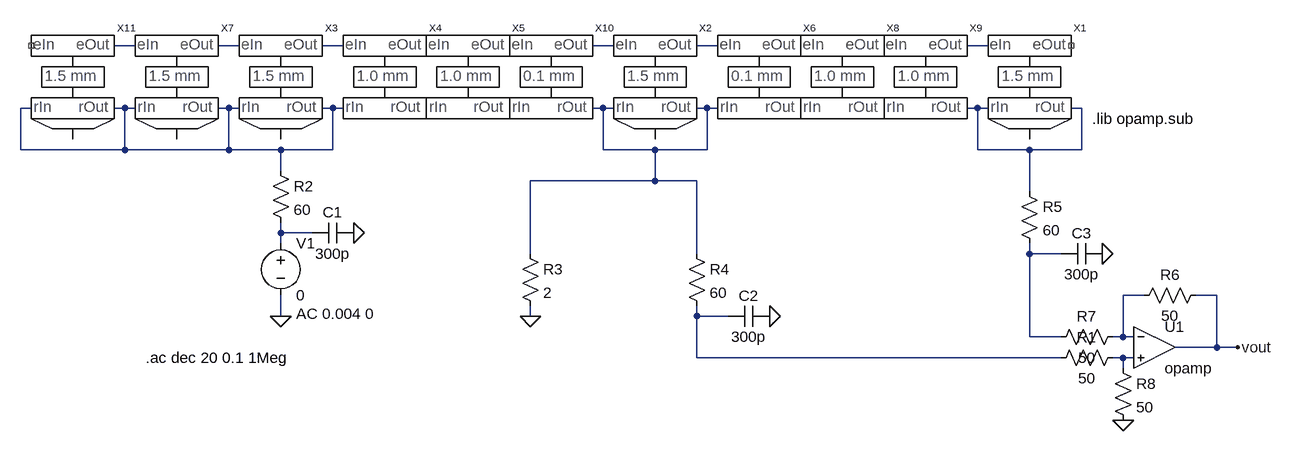
[diagram p0: schematic 0_nstCircuitSim.asc]
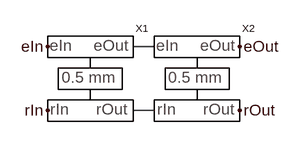
[diagram p1: sub-circuit baseunit_1p0mm.asc]
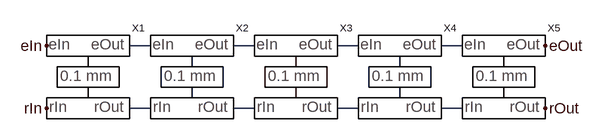
[diagram p2: sub-circuit baseunit_0p5mm.asc]
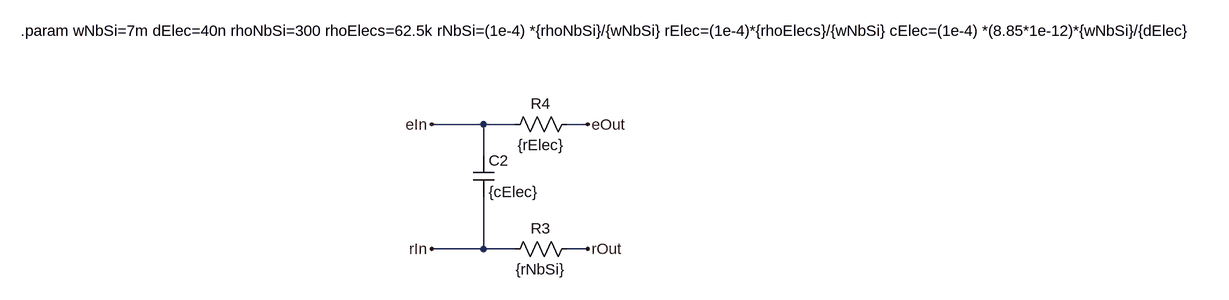
[diagram p3: sub-circuit baseunit_0p1mm.asc]
0_nstCircuitSim.asc, the LTspice schematic file:
Version 4
SHEET 1 1276 692
WIRE -624 96 -656 96
WIRE -464 96 -496 96
WIRE -304 96 -336 96
WIRE 112 96 80 96
WIRE 272 96 240 96
WIRE 688 96 656 96
WIRE -784 192 -800 192
WIRE -640 192 -656 192
WIRE -624 192 -640 192
WIRE -480 192 -496 192
WIRE -464 192 -480 192
WIRE -320 192 -336 192
WIRE -304 192 -320 192
WIRE 96 192 80 192
WIRE 112 192 96 192
WIRE 256 192 240 192
WIRE 272 192 256 192
WIRE 672 192 656 192
WIRE 688 192 672 192
WIRE 832 192 816 192
WIRE -800 256 -800 192
WIRE -640 256 -640 192
WIRE -640 256 -800 256
WIRE -480 256 -480 192
WIRE -480 256 -640 256
WIRE -400 256 -480 256
WIRE -320 256 -320 192
WIRE -320 256 -400 256
WIRE 96 256 96 192
WIRE 176 256 96 256
WIRE 256 256 256 192
WIRE 256 256 176 256
WIRE 672 256 672 192
WIRE 752 256 672 256
WIRE 832 256 832 192
WIRE 832 256 752 256
WIRE -400 288 -400 256
WIRE 176 304 176 256
WIRE 176 304 -16 304
WIRE 240 304 176 304
WIRE 752 320 752 256
WIRE -400 384 -400 368
WIRE -352 384 -400 384
WIRE -400 400 -400 384
WIRE -16 416 -16 304
WIRE 240 416 240 304
WIRE 752 416 752 400
WIRE 800 416 752 416
WIRE 928 480 896 480
WIRE 1040 480 1008 480
WIRE -400 512 -400 480
WIRE -16 512 -16 496
WIRE 240 512 240 496
WIRE 288 512 240 512
WIRE 752 544 752 416
WIRE 800 544 752 544
WIRE 896 544 896 480
WIRE 896 544 880 544
WIRE 912 544 896 544
WIRE 1040 560 1040 480
WIRE 1040 560 976 560
WIRE 1072 560 1040 560
WIRE 240 576 240 512
WIRE 800 576 240 576
WIRE 896 576 880 576
WIRE 912 576 896 576
WIRE 896 592 896 576
FLAG -16 512 0
FLAG -400 512 0
FLAG 1072 560 vout
FLAG 864 416 0
FLAG 352 512 0
FLAG -288 384 0
FLAG 896 672 0
SYMBOL voltage -400 384 R0
WINDOW 123 24 124 Left 2
WINDOW 39 0 0 Left 0
SYMATTR Value2 AC 0.004 0
SYMATTR InstName V1
SYMATTR Value 0
SYMBOL OpAmps\\opamp 944 496 R0
SYMATTR InstName U1
SYMBOL res -416 272 R0
SYMATTR InstName R2
SYMATTR Value 60
SYMBOL res -32 400 R0
SYMATTR InstName R3
SYMATTR Value 2
SYMBOL res 224 400 R0
SYMATTR InstName R4
SYMATTR Value 60
SYMBOL res 736 304 R0
SYMATTR InstName R5
SYMATTR Value 60
SYMBOL baseUnit_1p0mm -240 144 R0
SYMATTR InstName X4
SYMBOL baseUnit_1p0mm -112 144 R0
SYMATTR InstName X5
SYMBOL baseUnit_1p0mm 464 144 R0
SYMATTR InstName X8
SYMBOL baseUnit_1p0mm 592 144 R0
SYMATTR InstName X9
SYMBOL baseUnit_0p1mm 336 144 R0
SYMATTR InstName X6
SYMBOL cap -288 368 R90
WINDOW 0 0 32 VBottom 2
WINDOW 3 32 32 VTop 2
SYMATTR InstName C1
SYMATTR Value 300p
SYMBOL cap 352 496 R90
WINDOW 0 0 32 VBottom 2
WINDOW 3 32 32 VTop 2
SYMATTR InstName C2
SYMATTR Value 300p
SYMBOL cap 864 400 R90
WINDOW 0 0 32 VBottom 2
WINDOW 3 32 32 VTop 2
SYMATTR InstName C3
SYMATTR Value 300p
SYMBOL res 896 560 R90
WINDOW 0 0 56 VBottom 2
WINDOW 3 32 56 VTop 2
SYMATTR InstName R1
SYMATTR Value 50
SYMBOL res 1024 464 R90
WINDOW 0 0 56 VBottom 2
WINDOW 3 32 56 VTop 2
SYMATTR InstName R6
SYMATTR Value 50
SYMBOL res 896 528 R90
WINDOW 0 0 56 VBottom 2
WINDOW 3 32 56 VTop 2
SYMATTR InstName R7
SYMATTR Value 50
SYMBOL res 880 576 R0
SYMATTR InstName R8
SYMATTR Value 50
SYMBOL contactUnit_1p5mm -400 144 R0
SYMATTR InstName X3
SYMBOL contactUnit_1p5mm -560 144 R0
SYMATTR InstName X7
SYMBOL baseUnit_0p1mm 16 144 R0
SYMATTR InstName X10
SYMBOL contactUnit_1p5mm 752 144 R0
SYMATTR InstName X1
SYMBOL contactUnit_1p5mm 176 144 R0
SYMATTR InstName X2
SYMBOL contactUnit_1p5mm -720 144 R0
SYMATTR InstName X11
TEXT 848 208 Left 2 !.lib opamp.sub
TEXT -608 576 Left 2 !.ac dec 20 0.1 1Meg

baseunit_1p0mm.asc, the sub-circuit schematic file:
Version 4
SHEET 1 880 680
WIRE 112 80 80 80
WIRE 112 176 80 176
FLAG -48 80 eIn
FLAG -48 176 rIn
FLAG 240 80 eOut
FLAG 240 176 rOut
SYMBOL baseUnit_0p5mm 16 128 R0
SYMATTR InstName X1
SYMBOL baseUnit_0p5mm 176 128 R0
SYMATTR InstName X2

baseunit_0p5mm.asc, the sub-circuit schematic file:
Version 4
SHEET 1 880 680
WIRE 112 80 80 80
WIRE 272 80 240 80
WIRE 432 80 400 80
WIRE 592 80 560 80
WIRE 112 176 80 176
WIRE 272 176 240 176
WIRE 432 176 400 176
WIRE 592 176 560 176
FLAG -48 80 eIn
FLAG -48 176 rIn
FLAG 720 80 eOut
FLAG 720 176 rOut
SYMBOL baseUnit_0p1mm 16 128 R0
SYMATTR InstName X1
SYMBOL baseUnit_0p1mm 176 128 R0
SYMATTR InstName X2
SYMBOL baseUnit_0p1mm 336 128 R0
SYMATTR InstName X3
SYMBOL baseUnit_0p1mm 496 128 R0
SYMATTR InstName X4
SYMBOL baseUnit_0p1mm 656 128 R0
SYMATTR InstName X5

baseunit_0p1mm.asc, the sub-circuit schematic file:
Version 4
SHEET 1 17700 1016
WIRE 464 -16 384 -16
WIRE 512 -16 464 -16
WIRE 624 -16 592 -16
WIRE 464 32 464 -16
WIRE 464 176 464 96
WIRE 464 176 384 176
WIRE 512 176 464 176
WIRE 624 176 592 176
FLAG 384 -16 eIn
FLAG 624 -16 eOut
FLAG 384 176 rIn
FLAG 624 176 rOut
SYMBOL res 608 160 R90
WINDOW 0 0 56 VBottom 2
WINDOW 3 32 56 VTop 2
SYMATTR InstName R3
SYMATTR Value {rNbSi}
SYMBOL res 608 -32 R90
WINDOW 0 0 56 VBottom 2
WINDOW 3 32 56 VTop 2
SYMATTR InstName R4
SYMATTR Value {rElec}
SYMBOL cap 448 32 R0
SYMATTR InstName C2
SYMATTR Value {cElec}
TEXT -248 -160 Left 2 !.param wNbSi=7m dElec=40n rhoNbSi=300 rhoElecs=62.5k rNbSi=(1e-4) *{rhoNbSi}/{wNbSi} rElec=(1e-4)*{rhoElecs}/{wNbSi} cElec=(1e-4) *(8.85*1e-12)*{wNbSi}/{dElec}

The netlist it stands for:
* 0_nstCircuitSim.asc
V1 N010 0 0 AC 0.004 0
XU1 N012 N014 vout opamp Aol=100K GBW=10Meg  ; pins invin noninvin out
R2 N007 N010 60
R3 N008 0 2
R4 N008 N013 60
R5 N009 N011 60
XX4 N003 P001 N007 P002 baseunit_1p0mm
XX5 P001 P003 P002 P004 baseunit_1p0mm
XX8 P005 P006 P007 P008 baseunit_1p0mm
XX9 P006 N006 P008 N009 baseunit_1p0mm
XX6 N005 P005 N008 P007 baseunit_0p1mm
C1 0 N010 300p
C2 0 N013 300p
C3 0 N011 300p
R1 N014 N013 50
R6 vout N012 50
R7 N012 N011 50
R8 N014 0 50
XX3 N002 N003 N007 N007 contactUnit_1p5mm  ; pins eIn eOut rIn rOut
XX7 N001 N002 N007 N007 contactUnit_1p5mm  ; pins eIn eOut rIn rOut
XX10 P003 N004 P004 N008 baseunit_0p1mm
XX1 N006 NC_01 N009 N009 contactUnit_1p5mm  ; pins eIn eOut rIn rOut
XX2 N004 N005 N008 N008 contactUnit_1p5mm  ; pins eIn eOut rIn rOut
XX11 NC_02 N001 N007 N007 contactUnit_1p5mm  ; pins eIn eOut rIn rOut

* block symbol definitions
.subckt baseunit_1p0mm eIn eOut rIn rOut
XX1 eIn N001 rIn N002 baseunit_0p5mm
XX2 N001 eOut N002 rOut baseunit_0p5mm
.ends baseunit_1p0mm

.subckt baseunit_0p5mm eIn eOut rIn rOut
XX1 eIn N001 rIn N005 baseunit_0p1mm
XX2 N001 N002 N005 N006 baseunit_0p1mm
XX3 N002 N003 N006 N007 baseunit_0p1mm
XX4 N003 N004 N007 N008 baseunit_0p1mm
XX5 N004 eOut N008 rOut baseunit_0p1mm
.ends baseunit_0p5mm

.subckt baseunit_0p1mm eIn eOut rIn rOut
R3 rOut rIn {rNbSi}
R4 eOut eIn {rElec}
C2 eIn rIn {cElec}
.param wNbSi=7m dElec=40n rhoNbSi=300 rhoElecs=62.5k rNbSi=(1e-4) *{rhoNbSi}/{wNbSi} rElec=(1e-4)*{rhoElecs}/{wNbSi} cElec=(1e-4) *(8.85*1e-12)*{wNbSi}/{dElec}
.ends baseunit_0p1mm

.lib opamp.sub
.ac dec 20 0.1 1Meg
.backanno
.end

* Results of the author's LTspice run, read from the files saved beside the schematic
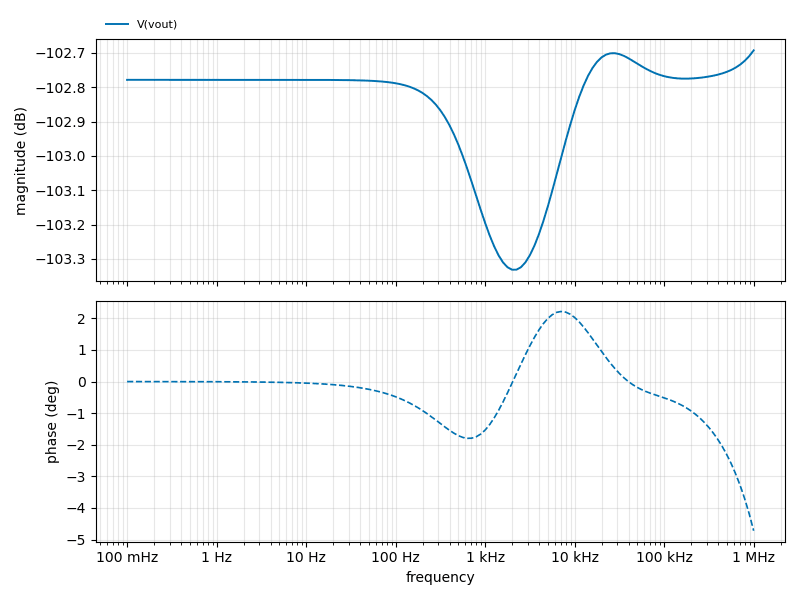
[diagram p4: AC Analysis of 0_nstCircuitSim.asc, plotted from the saved traces]
* AC Analysis, 1 run:
*   V(vout): -102.78 dB at 100 mHz, -102.69 dB at 1 MHz, peak -102.69 dB at 1 MHz